# EAGLE design placa_mux (EAGLE 9.6.2)
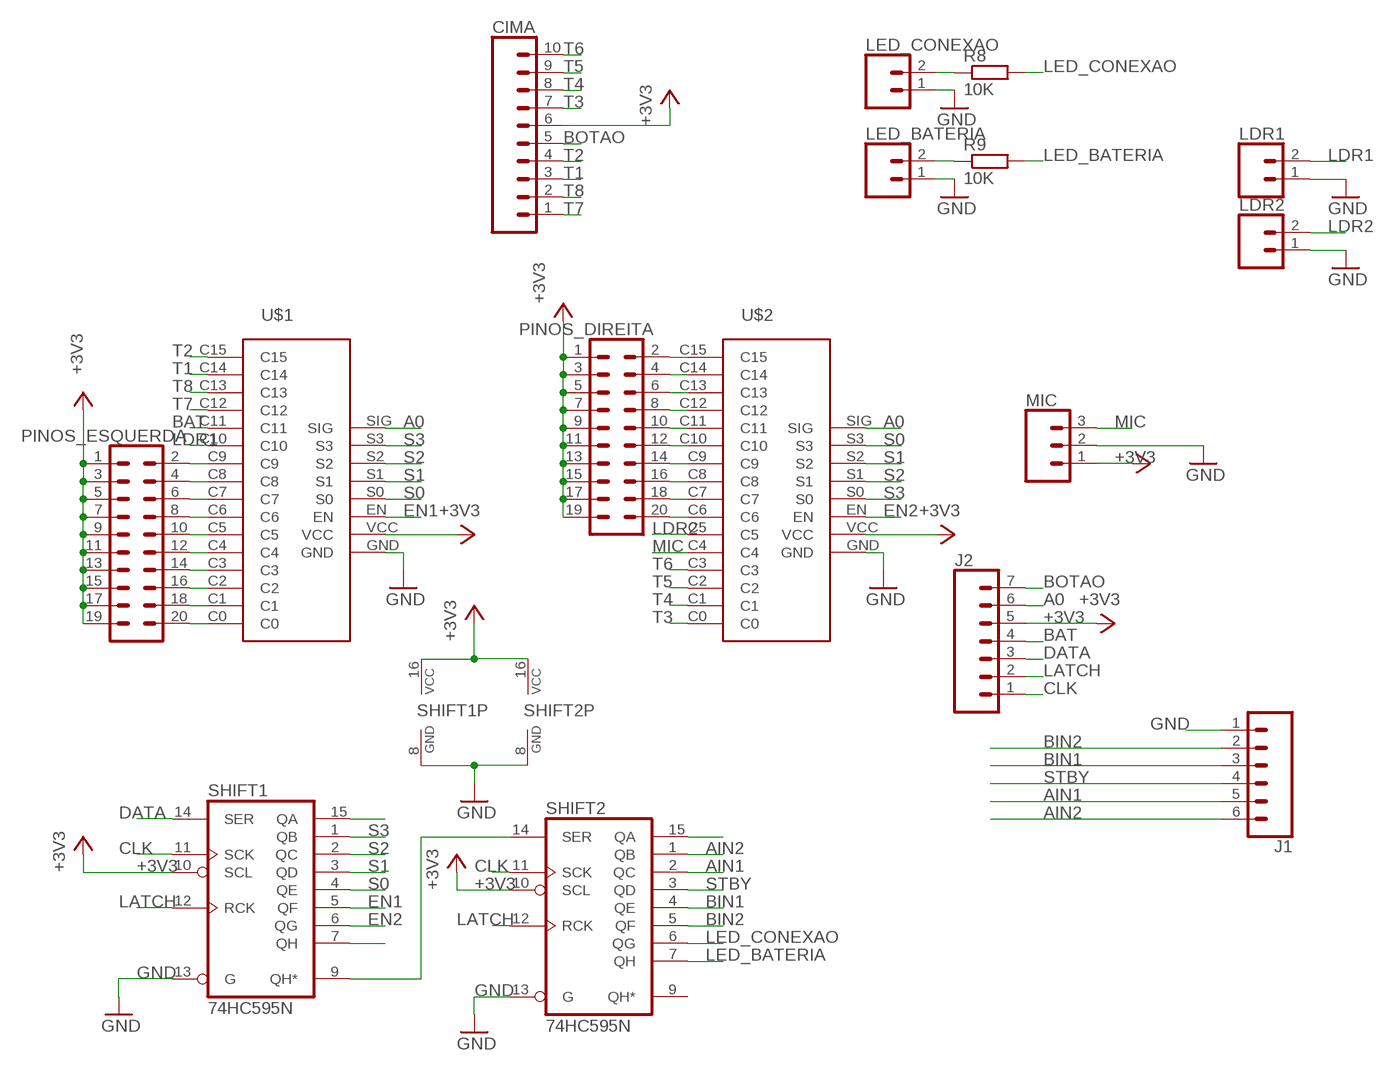
[diagram p0: schematic, sheet 1]

## Parts
CIMA  CONN_10"  [1X10]
J1  CONN_06SILK_FEMALE_PTH  [1X06]
J2  CONN_07  [1X07]
LDR1  CONN_02  [1X02]
LDR2  CONN_02  [1X02]
LED_BATERIA  CONN_02  [1X02]
LED_CONEXAO  CONN_02  [1X02]
MIC  CONN_03  [1X03]
PINOS_DIREITA  CONN_10X2  [2X10]
PINOS_ESQUERDA  CONN_10X2  [2X10]
R8  10K  R-EU_0204/7  [0204/7]
R9  10K  R-EU_0204/7  [0204/7]
SHIFT1  74HC595N  [DIL16]
SHIFT2  74HC595N  [DIL16]
U$1  4067_MODULE  [4067_MODULE]
U$2  4067_MODULE  [4067_MODULE]

## Nets
+3V3: CIMA.6 J2.5 MIC.1 PINOS_DIREITA.1 PINOS_DIREITA.3 PINOS_DIREITA.5 PINOS_DIREITA.7 PINOS_DIREITA.9 PINOS_DIREITA.11 PINOS_DIREITA.13 PINOS_DIREITA.15 PINOS_DIREITA.17 PINOS_DIREITA.19 PINOS_ESQUERDA.1 PINOS_ESQUERDA.3 PINOS_ESQUERDA.5 PINOS_ESQUERDA.7 PINOS_ESQUERDA.9 PINOS_ESQUERDA.11 PINOS_ESQUERDA.13 PINOS_ESQUERDA.15 PINOS_ESQUERDA.17 PINOS_ESQUERDA.19 SHIFT1.10(SCL) SHIFT1.16(VCC) SHIFT2.10(SCL) SHIFT2.16(VCC) U$1.VCC U$2.VCC
A0: J2.6 U$1.SIG U$2.SIG
AIN1: J1.5 SHIFT2.2(QC)
AIN2: J1.6 SHIFT2.1(QB)
BAT: J2.4 U$1.C11
BIN1: J1.3 SHIFT2.4(QE)
BIN2: J1.2 SHIFT2.5(QF)
BOTAO: CIMA.5 J2.7
CLK: J2.1 SHIFT1.11(SCK) SHIFT2.11(SCK)
DATA: J2.3 SHIFT1.14(SER)
EN1: SHIFT1.5(QF) U$1.EN
EN2: SHIFT1.6(QG) U$2.EN
GND: J1.1 LDR1.1 LDR2.1 LED_BATERIA.1 LED_CONEXAO.1 MIC.2 SHIFT1.8(GND) SHIFT1.13(G) SHIFT2.8(GND) SHIFT2.13(G) U$1.GND U$2.GND
LATCH: J2.2 SHIFT1.12(RCK) SHIFT2.12(RCK)
LDR1: LDR1.2 U$1.C10
LDR2: LDR2.2 U$2.C5
LED_BATERIA: R9.2 SHIFT2.7(QH)
LED_CONEXAO: R8.2 SHIFT2.6(QG)
MIC: MIC.3 U$2.C4
N$1: PINOS_ESQUERDA.2 U$1.C9
N$2: PINOS_ESQUERDA.4 U$1.C8
N$3: PINOS_ESQUERDA.6 U$1.C7
N$4: PINOS_ESQUERDA.8 U$1.C6
N$5: SHIFT1.9(QH*) SHIFT2.14(SER)
N$6: PINOS_ESQUERDA.10 U$1.C5
N$7: PINOS_ESQUERDA.12 U$1.C4
N$8: PINOS_DIREITA.2 U$2.C15
N$9: PINOS_DIREITA.4 U$2.C14
N$10: PINOS_DIREITA.6 U$2.C13
N$11: PINOS_DIREITA.8 U$2.C12
N$12: PINOS_DIREITA.10 U$2.C11
N$13: PINOS_DIREITA.12 U$2.C10
N$14: PINOS_DIREITA.14 U$2.C9
N$15: PINOS_DIREITA.16 U$2.C8
N$16: PINOS_DIREITA.18 U$2.C7
N$17: PINOS_DIREITA.20 U$2.C6
N$18: PINOS_ESQUERDA.14 U$1.C3
N$19: PINOS_ESQUERDA.16 U$1.C2
N$20: PINOS_ESQUERDA.18 U$1.C1
N$21: PINOS_ESQUERDA.20 U$1.C0
N$22: LED_CONEXAO.2 R8.1
N$23: LED_BATERIA.2 R9.1
N$38: SHIFT1.15(QA)
N$46: SHIFT1.7(QH)
N$47: SHIFT2.15(QA)
S0: SHIFT1.4(QE) U$1.S0 U$2.S3
S1: SHIFT1.3(QD) U$1.S1 U$2.S2
S2: SHIFT1.2(QC) U$1.S2 U$2.S1
S3: SHIFT1.1(QB) U$1.S3 U$2.S0
STBY: J1.4 SHIFT2.3(QD)
T1: CIMA.3 U$1.C14
T2: CIMA.4 U$1.C15
T3: CIMA.7 U$2.C0
T4: CIMA.8 U$2.C1
T5: CIMA.9 U$2.C2
T6: CIMA.10 U$2.C3
T7: CIMA.1 U$1.C12
T8: CIMA.2 U$1.C13
Unconnected: SHIFT2.9(QH*)

## Library data of the parts
CIMA = SparkFun-Connectors:CONN_10: Multi connection point. Often used as Generic Header-pin footprint for 0.1 inch spaced/style header connections On any of the 0.1 inch spaced packages, you can populate with these: Break Away Headers - Straight <https://www.sparkfun.com/products/116> (PRT-00116) Break Away Male Headers - Right Angle <https://www.sparkfun.com/products/553> (PRT-00553) Female Headers <https://www.sparkfun.com/products/115> (PRT-00115) Break Away Headers - Machine Pin <https://www.sparkfun.com/products/117> (PRT-00117) Break Away Female Headers - Swiss Machine Pin <https://www.sparkfun.com/products/743> (PRT-00743) Arduino Stackable Header - 10 Pin <https://www.sparkfun.com/products/11376> (PRT-11376) For SCREWTERMINALS and SPRING TERMINALS visit here: Screw Terimnals on SparkFun.com <https://www.sparkfun.com/search/results?term=Screw+Terminals> (5mm/3.5mm/2.54mm spacing) This device is also useful as a general connection point to wire up your design to another part of your project. Our various solder wires solder well into these plated through hole pads. Hook-Up Wire - Assortment (Stranded, 22 AWG) <https://www.sparkfun.com/products/11375> (PRT-11375) Hook-Up Wire - Assortment (Solid Core, 22 AWG) <https://www.sparkfun.com/products/11367> (PRT-11367) View the entire wire category on our website here <https://www.sparkfun.com/categories/141> Special notes: Molex polarized connector foot print use with SKU : PRT-08231 with associated crimp pins and housings. 1MM SMD Version SKU: PRT-10208 NOTES ON THE VARIANTS LOCK and LOCK_LONGPADS... This footprint was designed to help hold the alignment of a through-hole component (i.e. 6-pin header) while soldering it into place. You may notice that each hole has been shifted either up or down by 0.005 of an inch from it's more standard position (which is a perfectly straight line). This slight alteration caused the pins (the squares in the middle) to touch the edges of the holes. Because they are alternating, it causes a "brace" to hold the component in place. 0.005 has proven to be the perfect amount of "off-center" position when using our standard breakaway headers. Although looks a little odd when you look at the bare footprint, once you have a header in there, the alteration is very hard to notice. Also,if you push a header all the way into place, it is covered up entirely on the bottom side.; PROD_ID: CONN-11563
J1 = SparkFun-Connectors:CONN_06: Multi connection point. Often used as Generic Header-pin footprint for 0.1 inch spaced/style header connections On any of the 0.1 inch spaced packages, you can populate with these: Break Away Headers - Straight <https://www.sparkfun.com/products/116> (PRT-00116) Break Away Male Headers - Right Angle <https://www.sparkfun.com/products/553> (PRT-00553) Female Headers <https://www.sparkfun.com/products/115> (PRT-00115) Break Away Headers - Machine Pin <https://www.sparkfun.com/products/117> (PRT-00117) Break Away Female Headers - Swiss Machine Pin <https://www.sparkfun.com/products/743> (PRT-00743) Arduino Stackable Header - 6 Pin <https://www.sparkfun.com/products/9280> (PRT-09280) For SCREWTERMINALS and SPRING TERMINALS visit here: Screw Terimnals on SparkFun.com <https://www.sparkfun.com/search/results?term=Screw+Terminals> (5mm/3.5mm/2.54mm spacing) This device is also useful as a general connection point to wire up your design to another part of your project. Our various solder wires solder well into these plated through hole pads. Hook-Up Wire - Assortment (Stranded, 22 AWG) <https://www.sparkfun.com/products/11375> (PRT-11375) Hook-Up Wire - Assortment (Solid Core, 22 AWG) <https://www.sparkfun.com/products/11367> (PRT-11367) View the entire wire category on our website here <https://www.sparkfun.com/categories/141>; PROD_ID: CONN-08437
J2 = SparkFun-Connectors:CONN_07: Multi connection point. Often used as Generic Header-pin footprint for 0.1 inch spaced/style header connections On any of the 0.1 inch spaced packages, you can populate with these: Break Away Headers - Straight <https://www.sparkfun.com/products/116> (PRT-00116) Break Away Male Headers - Right Angle <https://www.sparkfun.com/products/553> (PRT-00553) Female Headers <https://www.sparkfun.com/products/115> (PRT-00115) Break Away Headers - Machine Pin <https://www.sparkfun.com/products/117> (PRT-00117) Break Away Female Headers - Swiss Machine Pin <https://www.sparkfun.com/products/743> (PRT-00743) For SCREWTERMINALS and SPRING TERMINALS visit here: Screw Terimnals on SparkFun.com <https://www.sparkfun.com/search/results?term=Screw+Terminals> (5mm/3.5mm/2.54mm spacing) This device is also useful as a general connection point to wire up your design to another part of your project. Our various solder wires solder well into these plated through hole pads. Hook-Up Wire - Assortment (Stranded, 22 AWG) <https://www.sparkfun.com/products/11375> (PRT-11375) Hook-Up Wire - Assortment (Solid Core, 22 AWG) <https://www.sparkfun.com/products/11367> (PRT-11367) View the entire wire category on our website here <https://www.sparkfun.com/categories/141> Special notes: Molex polarized connector foot print use with SKU : PRT-08231 with associated crimp pins and housings. 1MM SMD Version SKU: PRT-10208 NOTES ON THE VARIANTS LOCK and LOCK_LONGPADS... This footprint was designed to help hold the alignment of a through-hole component (i.e. 6-pin header) while soldering it into place. You may notice that each hole has been shifted either up or down by 0.005 of an inch from it's more standard position (which is a perfectly straight line). This slight alteration caused the pins (the squares in the middle) to touch the edges of the holes. Because they are alternating, it causes a "brace" to hold the component in place. 0.005 has proven to be the perfect amount of "off-center" position when using our standard breakaway headers. Although looks a little odd when you look at the bare footprint, once you have a header in there, the alteration is very hard to notice. Also,if you push a header all the way into place, it is covered up entirely on the bottom side.
LDR1 LDR2 LED_BATERIA LED_CONEXAO = SparkFun-Connectors:CONN_02: Multi connection point. Often used as Generic Header-pin footprint for 0.1 inch spaced/style header connections On any of the 0.1 inch spaced packages, you can populate with these: Break Away Headers - Straight <https://www.sparkfun.com/products/116> (PRT-00116) Break Away Male Headers - Right Angle <https://www.sparkfun.com/products/553> (PRT-00553) Female Headers <https://www.sparkfun.com/products/115> (PRT-00115) Break Away Headers - Machine Pin <https://www.sparkfun.com/products/117> (PRT-00117) Break Away Female Headers - Swiss Machine Pin <https://www.sparkfun.com/products/743> (PRT-00743) For SCREWTERMINALS and SPRING TERMINALS visit here: Screw Terimnals on SparkFun.com <https://www.sparkfun.com/search/results?term=Screw+Terminals> (5mm/3.5mm/2.54mm spacing) This device is also useful as a general connection point to wire up your design to another part of your project. Our various solder wires solder well into these plated through hole pads. Hook-Up Wire - Assortment (Stranded, 22 AWG) <https://www.sparkfun.com/products/11375> (PRT-11375) Hook-Up Wire - Assortment (Solid Core, 22 AWG) <https://www.sparkfun.com/products/11367> (PRT-11367) View the entire wire category on our website here <https://www.sparkfun.com/categories/141> Special notes: Molex polarized connector foot print use with: PRT-08233 with associated crimp pins and housings. 2.54_SCREWTERM for use with PRT-10571. 3.5mm Screw Terminal footprints for PRT-08084 5mm Screw Terminal footprints for use with PRT-08432
MIC = SparkFun-Connectors:CONN_03: Multi connection point. Often used as Generic Header-pin footprint for 0.1 inch spaced/style header connections On any of the 0.1 inch spaced packages, you can populate with these: Break Away Headers - Straight <https://www.sparkfun.com/products/116> (PRT-00116) Break Away Male Headers - Right Angle <https://www.sparkfun.com/products/553> (PRT-00553) Female Headers <https://www.sparkfun.com/products/115> (PRT-00115) Break Away Headers - Machine Pin <https://www.sparkfun.com/products/117> (PRT-00117) Break Away Female Headers - Swiss Machine Pin <https://www.sparkfun.com/products/743> (PRT-00743) Stackable Header - 3 Pin (Female, 0.1") <https://www.sparkfun.com/products/13875> (PRT-13875) For SCREWTERMINALS and SPRING TERMINALS visit here: Screw Terimnals on SparkFun.com <https://www.sparkfun.com/search/results?term=Screw+Terminals> (5mm/3.5mm/2.54mm spacing) This device is also useful as a general connection point to wire up your design to another part of your project. Our various solder wires solder well into these plated through hole pads. Hook-Up Wire - Assortment (Stranded, 22 AWG) <https://www.sparkfun.com/products/11375> (PRT-11375) Hook-Up Wire - Assortment (Solid Core, 22 AWG) <https://www.sparkfun.com/products/11367> (PRT-11367) View the entire wire category on our website here <https://www.sparkfun.com/categories/141> Special notes: Molex polarized connector foot print use with SKU : PRT-08232 with associated crimp pins and housings.
PINOS_DIREITA PINOS_ESQUERDA = SparkFun-Connectors:CONN_10X2: Multi connection point. Often used as Generic Header-pin footprint for 0.1 inch spaced/style header connections On any of the 0.1 inch spaced packages, you can populate with these: Break Away Headers - Straight <https://www.sparkfun.com/products/116> (PRT-00116) Break Away Male Headers - Right Angle <https://www.sparkfun.com/products/553> (PRT-00553) Female Headers <https://www.sparkfun.com/products/115> (PRT-00115) Break Away Headers - Machine Pin <https://www.sparkfun.com/products/117> (PRT-00117) Break Away Female Headers - Swiss Machine Pin <https://www.sparkfun.com/products/743> (PRT-00743) Special note about the "SPECIAL" package: This was SPECIALLY designed to be used with our Graphic LCD Backpack. Be sure you want to use this! It is not only staggered on each line of header holes, but IT IS ALSO offset of the center point of the top and bottom lines by 5 mil. This causes the headers to lock into place on the "standard" footprint on the LCD screen. The extra squares on the tdocu layer are there simply to reference other pins (if you were to actually populate a longer header than ten long - this is what we do with the backpacks).
R8 R9 = rcl:R-EU_: RESISTOR, European symbol; SPICEPREFIX: R
SHIFT1 SHIFT2 = 74xx-eu:74*595: 8-bit SHIFT REGISTER, output latch
U$1 U$2 = personal:4067_MODULE

## Board
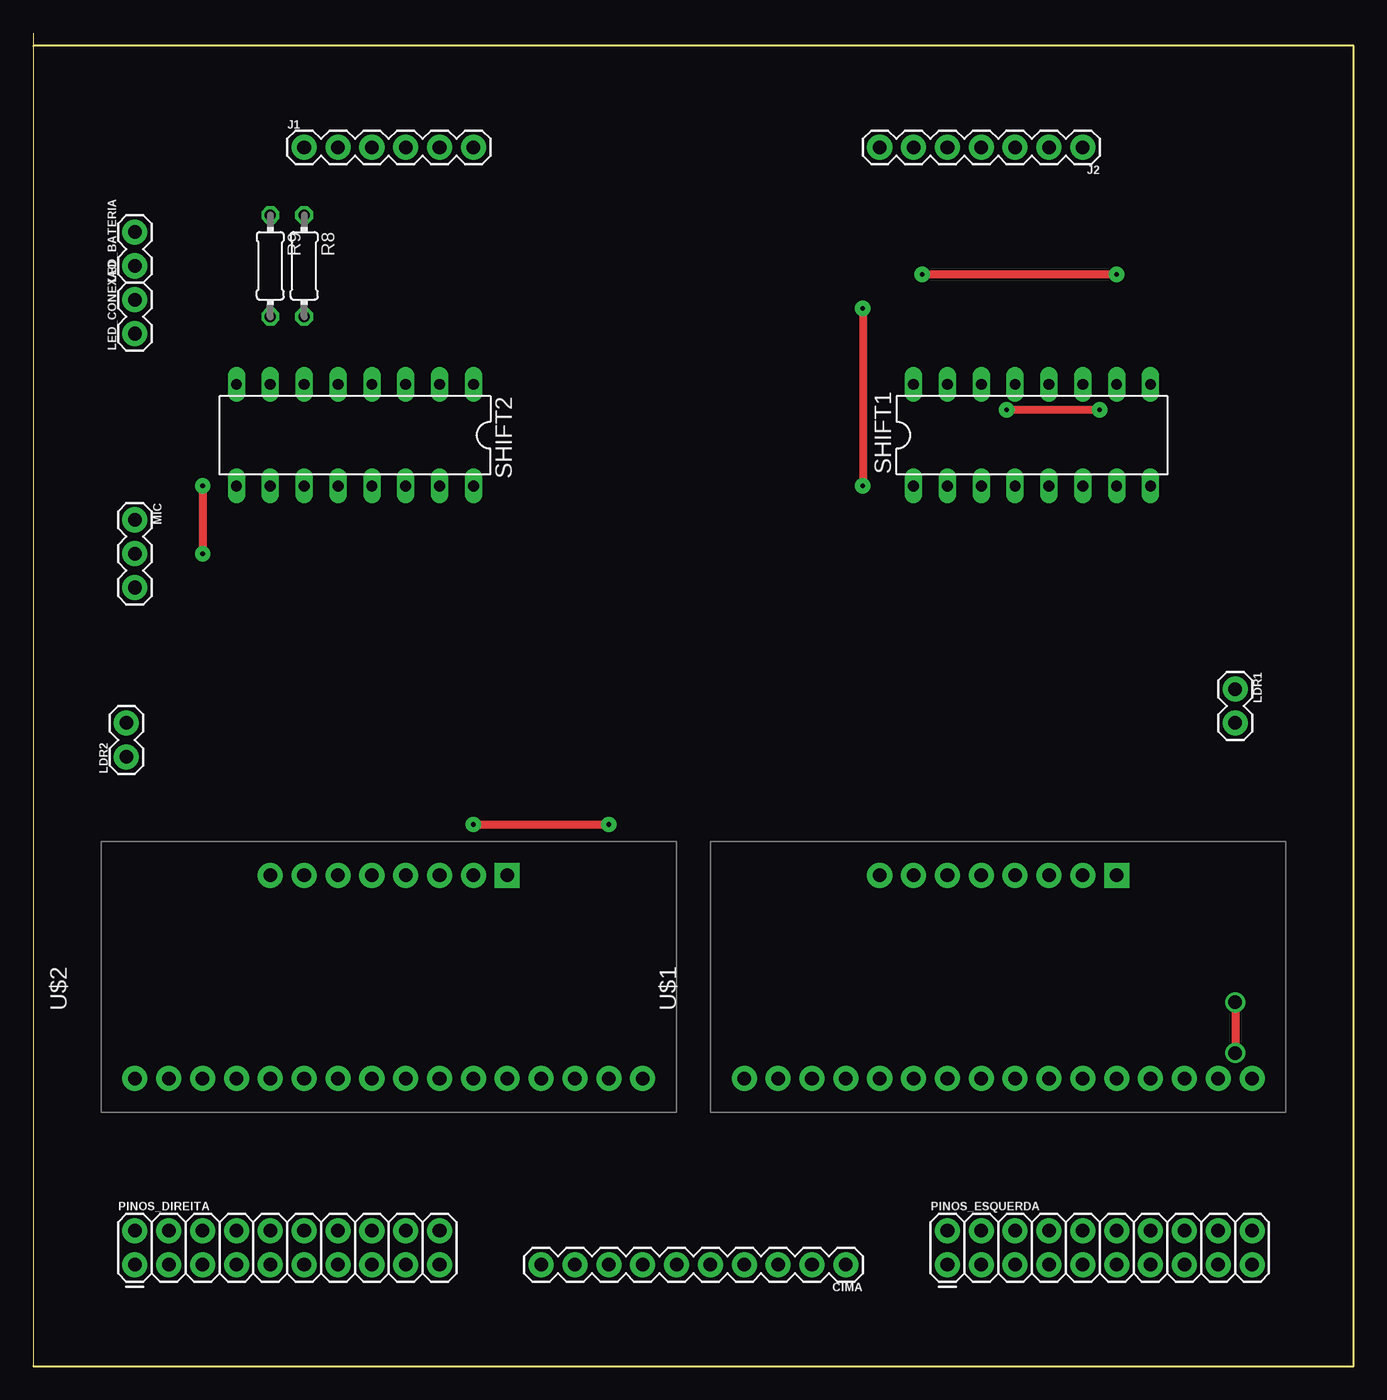
[diagram p1: board, top side]
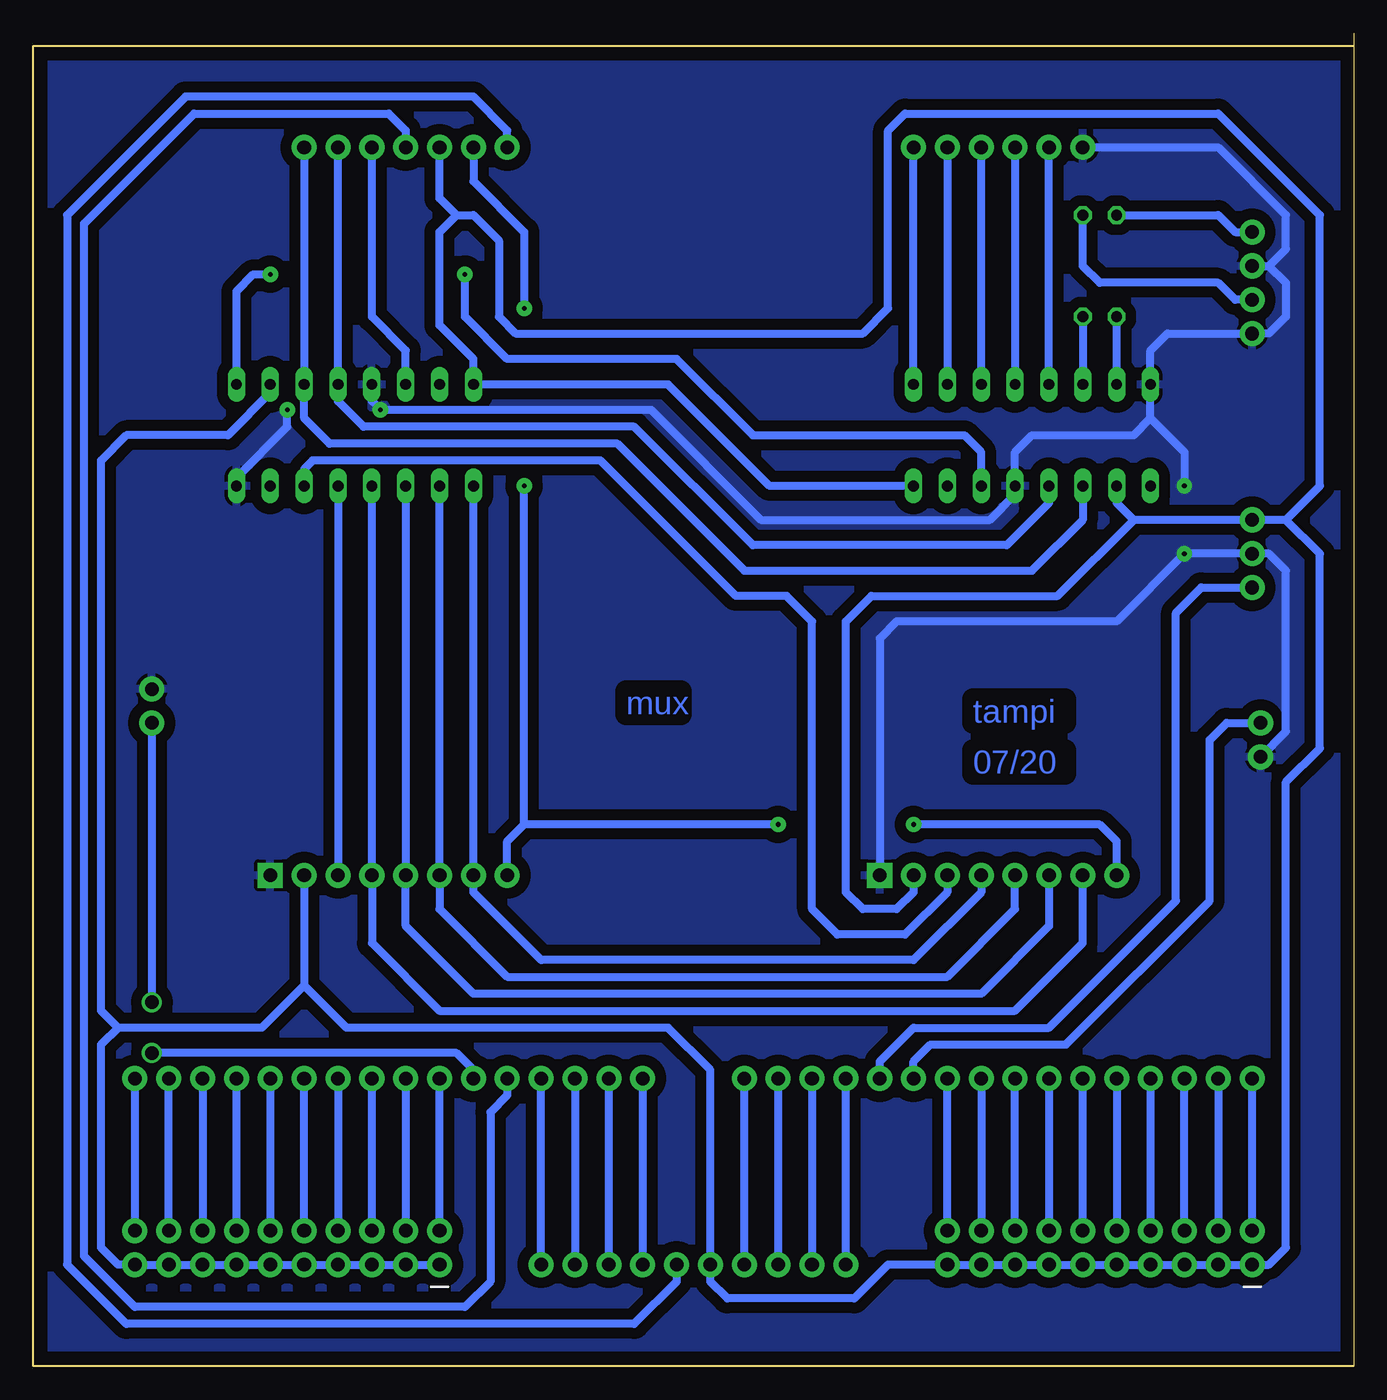
[diagram p2: board, bottom side, seen from below]

Size 99.06 x 100 mm. Coordinates in mm from the lower left corner, seen from the top.
Outline: 0,100 0,99.06
Outline: 0,99.06 0,0 99.06,0 99.06,99.06 0,99.06
Copper layers (1*16): Top 0.035mm / dielectric 1.5mm / Bottom 0.035mm
Design rules "default": minimum track width 6mil, minimum drill 0.35mm, track to track 6mil, track to pad 6mil, pad to pad 6mil, via to via 6mil, smd to smd 6mil, copper to edge 40mil, drill to drill 6mil, minimum pad ring 10mil, minimum via ring 8mil, stop-mask expansion 4mil, vias tented up to drill 0mil, thermal gap 10mil

### Footprints (pad centres in the part's own frame; a part is rotated, then mirrored left to right if it is on the bottom)
1X10 = drill 1.016 pad 1.88: 1 0,0; 2 2.54,0; 3 5.08,0; 4 7.62,0; 5 10.16,0; 6 12.7,0; 7 15.24,0; 8 17.78,0; 9 20.32,0; 10 22.86,0
1X06 = drill 1.016 pad 1.88: 1 0,0; 2 2.54,0; 3 5.08,0; 4 7.62,0; 5 10.16,0; 6 12.7,0
1X07 = drill 1.016 pad 1.88: 1 0,0; 2 2.54,0; 3 5.08,0; 4 7.62,0; 5 10.16,0; 6 12.7,0; 7 15.24,0
1X02 = drill 1.016 pad 1.88: 1 0,0; 2 2.54,0
1X03 = drill 1.016 pad 1.88: 1 0,0; 2 2.54,0; 3 5.08,0
2X10 = drill 1.016 pad 1.88: 1 0,0; 2 0,2.54; 3 2.54,0; 4 2.54,2.54; 5 5.08,0; 6 5.08,2.54; 7 7.62,0; 8 7.62,2.54; 9 10.16,0; 10 10.16,2.54; 11 12.7,0; 12 12.7,2.54; 13 15.24,0; 14 15.24,2.54; 15 17.78,0; 16 17.78,2.54; 17 20.32,0; 18 20.32,2.54; 19 22.86,0; 20 22.86,2.54
0204/7 = drill 0.813 octagon: 1 -3.81,0; 2 3.81,0
DIL16 = drill 0.813 long: 1 -8.89,-3.81; 2 -6.35,-3.81; 3 -3.81,-3.81; 4 -1.27,-3.81; 5 1.27,-3.81; 6 3.81,-3.81; 7 6.35,-3.81; 8 8.89,-3.81; 9 8.89,3.81; 10 6.35,3.81; 11 3.81,3.81; 12 1.27,3.81; 13 -1.27,3.81; 14 -3.81,3.81; 15 -6.35,3.81; 16 -8.89,3.81
4067_MODULE = drill 1.016 pad 1.88: C0 -8.89,-19.05; C1 -8.89,-16.51; C2 -8.89,-13.97; C3 -8.89,-11.43; C4 -8.89,-8.89; C5 -8.89,-6.35; C6 -8.89,-3.81; C7 -8.89,-1.27; C8 -8.89,1.27; C9 -8.89,3.81; C10 -8.89,6.35; C11 -8.89,8.89; C12 -8.89,11.43; C13 -8.89,13.97; C14 -8.89,16.51; C15 -8.89,19.05; EN 6.35,-3.81; S0 6.35,-1.27; S1 6.35,1.27; S2 6.35,3.81; S3 6.35,6.35; SIG 6.35,8.89; VCC 6.35,-6.35 | drill 1.016 pad 1.88 square: GND 6.35,-8.89

### Placement (x,y rotation side)
CIMA  60.96,7.62 180 top
J1  20.32,91.44 0 top
J2  78.74,91.44 180 top
LDR1  90.17,50.8 270 top
LDR2  6.99,45.72 90 top
LED_BATERIA  7.62,82.55 90 top
LED_CONEXAO  7.62,77.47 90 top
MIC  7.62,63.5 270 top
PINOS_DIREITA  7.62,7.62 0 top
PINOS_ESQUERDA  68.58,7.62 0 top
R8  20.32,82.55 270 top
R9  17.78,82.55 270 top
SHIFT1  74.93,69.85 0 top
SHIFT2  24.13,69.85 180 top
U$1  72.39,30.48 90 top
U$2  26.67,30.48 90 top

### Tracks (layer width: path | path; a pad name or v marks a point on that pad's centre or on a via)
+3V3
  Bottom 0.61: PINOS_ESQUERDA.1 PINOS_ESQUERDA.3 PINOS_ESQUERDA.5 PINOS_ESQUERDA.7 PINOS_ESQUERDA.9 PINOS_ESQUERDA.11 PINOS_ESQUERDA.13 PINOS_ESQUERDA.15 PINOS_ESQUERDA.17 PINOS_ESQUERDA.19 92.71,7.62 93.98,8.89 93.98,24.13 92.71,25.4 | 5.08,63.5 2.54,60.96 2.54,46.35 5.08,43.81 5.08,8.89 6.35,7.62 PINOS_DIREITA.1 PINOS_DIREITA.3 PINOS_DIREITA.5 PINOS_DIREITA.7 PINOS_DIREITA.9 PINOS_DIREITA.11 PINOS_DIREITA.13 PINOS_DIREITA.15 PINOS_DIREITA.17 PINOS_DIREITA.19 34.92,7.62 37.47,5.08 46.99,5.08 48.26,6.35 CIMA.6 48.26,22.23 51.44,25.4 75.56,25.4 78.74,28.57 | 5.08,63.5 MIC.1 16.51,63.5 | 16.51,63.5 17.78,64.77 SHIFT2.10 | U$2.VCC 33.02,35.56 34.29,34.29 36.83,34.29 38.1,35.56 38.1,55.88 36.2,57.78 22.23,57.78 16.51,63.5 | U$1.VCC 78.74,28.57 | SHIFT1.10 81.28,73.03 84.45,69.85 92.08,69.85 93.98,67.94 93.98,26.67 92.71,25.4 | SHIFT2.16 43.81,66.04 51.44,73.66 SHIFT1.16 66.04,75.56 68.58,78.11 68.58,85.09 67.31,86.36 | J2.5 68.58,87.63 67.31,86.36 | 67.31,86.36 66.04,86.36 64.14,84.45 64.14,78.74 62.87,77.47 36.83,77.47 34.92,79.38 34.92,92.71 33.66,93.98 10.16,93.98 2.54,86.36 2.54,66.04 5.08,63.5 | 78.74,28.57 81.92,25.4 92.71,25.4
A0  (via drill 0.35 pad 1.15)
  Top 0.61: v62.23,79.38 v62.23,66.04 | v33.02,40.64 v43.18,40.64
  Bottom 0.61: U$2.SIG 17.78,39.37 19.05,40.64 v33.02,40.64 | U$1.SIG 63.5,39.37 62.23,40.64 | v43.18,40.64 62.23,40.64 | 62.23,40.64 v62.23,66.04 | J2.6 66.04,88.9 62.23,85.09 v62.23,79.38
AIN1
  Bottom 0.61: J1.5 SHIFT2.2
AIN2
  Bottom 0.61: SHIFT2.1 J1.6
BAT
  Bottom 0.61: U$1.C11 63.5,20.32 64.77,19.05 64.77,6.35 66.67,4.45 91.44,4.45 95.25,8.26 95.25,85.72 87,93.98 72.39,93.98 71.12,92.71 J2.4
BIN1
  Bottom 0.61: J1.3 SHIFT2.4
BIN2
  Bottom 0.61: SHIFT2.5 J1.2
BOTAO
  Bottom 0.61: J2.7 63.5,92.71 66.04,95.25 87.63,95.25 96.52,86.36 96.52,7.62 92.08,3.17 53.98,3.17 50.8,6.35 CIMA.5
CLK
  Bottom 0.61: J2.1 SHIFT1.11 78.74,71.12 76.83,69.22 55.24,69.22 45.72,59.69 24.13,59.69 20.32,63.5 SHIFT2.11
DATA
  Bottom 0.61: SHIFT1.14 71.12,76.2 73.66,78.74 J2.3
EN1
  Bottom 0.61: SHIFT1.5 U$1.EN
EN2
  Bottom 0.61: U$2.EN 30.48,35.56 33.66,32.38 38.73,32.38 40.64,34.29 40.64,55.88 42.55,57.78 46.35,57.78 56.52,67.94 78.11,67.94 78.74,67.31 SHIFT1.6
GND  (via drill 0.35 pad 1.15)
  Top 0.61: v73.03,71.75 v80.01,71.75 | v12.7,66.04 v12.7,60.96
  Bottom 0.61: 15.24,71.12 16.51,69.85 24.13,69.85 25.4,68.58 SHIFT2.13 25.4,65.41 27.3,63.5 44.45,63.5 52.7,71.75 v73.03,71.75 73.66,72.39 SHIFT1.13 | 15.24,71.12 SHIFT2.8 15.24,76.2 13.97,77.47 LED_CONEXAO.1 6.35,77.47 5.08,78.74 5.08,81.28 6.35,82.55 | U$2.GND 35.56,54.61 34.29,55.88 17.78,55.88 v12.7,60.96 MIC.2 6.35,60.96 5.08,59.69 5.08,47.62 LDR2.1 | 15.24,71.12 12.7,68.58 v12.7,66.04 | SHIFT1.8 83.82,66.67 80.01,70.48 v80.01,71.75 | LED_BATERIA.1 6.35,82.55 | 6.35,82.55 5.08,83.82 5.08,86.36 10.16,91.44 J1.1
  pour Bottom (isolate 0.813): 0,0 99.06,0 99.06,99.06 0,99.06
LATCH
  Bottom 0.61: J2.2 SHIFT1.12 76.2,72.39 74.3,70.48 53.98,70.48 45.09,61.59 26.04,61.59 22.86,64.77 SHIFT2.12
LDR1  (via drill 1)
  Top 0.61: v90.17,27.3 v90.17,23.5
  Bottom 0.61: v90.17,23.5 67.31,23.5 66.04,22.23 U$1.C10 | LDR1.2 v90.17,27.3
LDR2
  Bottom 0.61: U$2.C5 33.02,22.86 31.75,24.13 21.59,24.13 10.79,34.92 10.79,46.99 9.53,48.26 LDR2.2
LED_BATERIA
  Bottom 0.61: SHIFT2.7 R9.2
LED_CONEXAO
  Bottom 0.61: R8.2 SHIFT2.6
MIC
  Bottom 0.61: U$2.C4 35.56,22.86 33.02,25.4 22.86,25.4 13.34,34.92 13.34,56.52 11.43,58.42 MIC.3
N$1
  Bottom 0.61: PINOS_ESQUERDA.2 U$1.C9
N$2
  Bottom 0.61: U$1.C8 PINOS_ESQUERDA.4
N$3
  Bottom 0.61: PINOS_ESQUERDA.6 U$1.C7
N$4
  Bottom 0.61: U$1.C6 PINOS_ESQUERDA.8
N$5  (via drill 0.35 pad 1.15)
  Top 0.61: v66.67,81.92 v81.28,81.92
  Bottom 0.61: SHIFT2.14 27.94,68.58 29.21,69.85 45.09,69.85 50.8,75.56 57.15,75.56 63.5,75.56 66.67,78.74 v66.67,81.92 | SHIFT1.9 83.82,80.64 82.55,81.92 v81.28,81.92
N$6
  Bottom 0.61: PINOS_ESQUERDA.10 U$1.C5
N$7
  Bottom 0.61: U$1.C4 PINOS_ESQUERDA.12
N$8
  Bottom 0.61: PINOS_DIREITA.2 U$2.C15
N$9
  Bottom 0.61: U$2.C14 PINOS_DIREITA.4
N$10
  Bottom 0.61: PINOS_DIREITA.6 U$2.C13
N$11
  Bottom 0.61: U$2.C12 PINOS_DIREITA.8
N$12
  Bottom 0.61: U$2.C11 PINOS_DIREITA.10
N$13
  Bottom 0.61: PINOS_DIREITA.12 U$2.C10
N$14
  Bottom 0.61: U$2.C9 PINOS_DIREITA.14
N$15
  Bottom 0.61: PINOS_DIREITA.16 U$2.C8
N$16
  Bottom 0.61: U$2.C7 PINOS_DIREITA.18
N$17
  Bottom 0.61: PINOS_DIREITA.20 U$2.C6
N$18
  Bottom 0.61: PINOS_ESQUERDA.14 U$1.C3
N$19
  Bottom 0.61: U$1.C2 PINOS_ESQUERDA.16
N$20
  Bottom 0.61: PINOS_ESQUERDA.18 U$1.C1
N$21
  Bottom 0.61: U$1.C0 PINOS_ESQUERDA.20
N$22
  Bottom 0.61: LED_CONEXAO.2 8.89,80.01 10.16,81.28 19.05,81.28 20.32,82.55 R8.1
N$23
  Bottom 0.61: R9.1 10.16,86.36 8.89,85.09 LED_BATERIA.2
S0
  Bottom 0.61: U$2.S3 20.32,31.75 25.4,26.67 68.58,26.67 73.66,31.75 U$1.S0 SHIFT1.4
S1
  Bottom 0.61: U$2.S2 22.86,33.02 27.94,27.94 66.04,27.94 71.12,33.02 U$1.S1 SHIFT1.3
S2
  Bottom 0.61: U$2.S1 25.4,34.29 30.48,29.21 63.5,29.21 68.58,34.29 U$1.S2 SHIFT1.2
S3
  Bottom 0.61: U$2.S0 27.94,35.56 33.02,30.48 60.96,30.48 66.04,35.56 U$1.S3 SHIFT1.1
STBY
  Bottom 0.61: SHIFT2.3 J1.4
T1
  Bottom 0.61: CIMA.3 U$1.C14
T2
  Bottom 0.61: U$1.C15 CIMA.4
T3
  Bottom 0.61: CIMA.7 U$2.C0
T4
  Bottom 0.61: U$2.C1 CIMA.8
T5
  Bottom 0.61: U$2.C2 CIMA.9
T6
  Bottom 0.61: CIMA.10 U$2.C3
T7
  Bottom 0.61: CIMA.1 U$1.C12
T8
  Bottom 0.61: U$1.C13 CIMA.2

### Text on the board
Bottom: mux | tampi | 07/20